# Altium project SmartHaloDD.PrjPcb
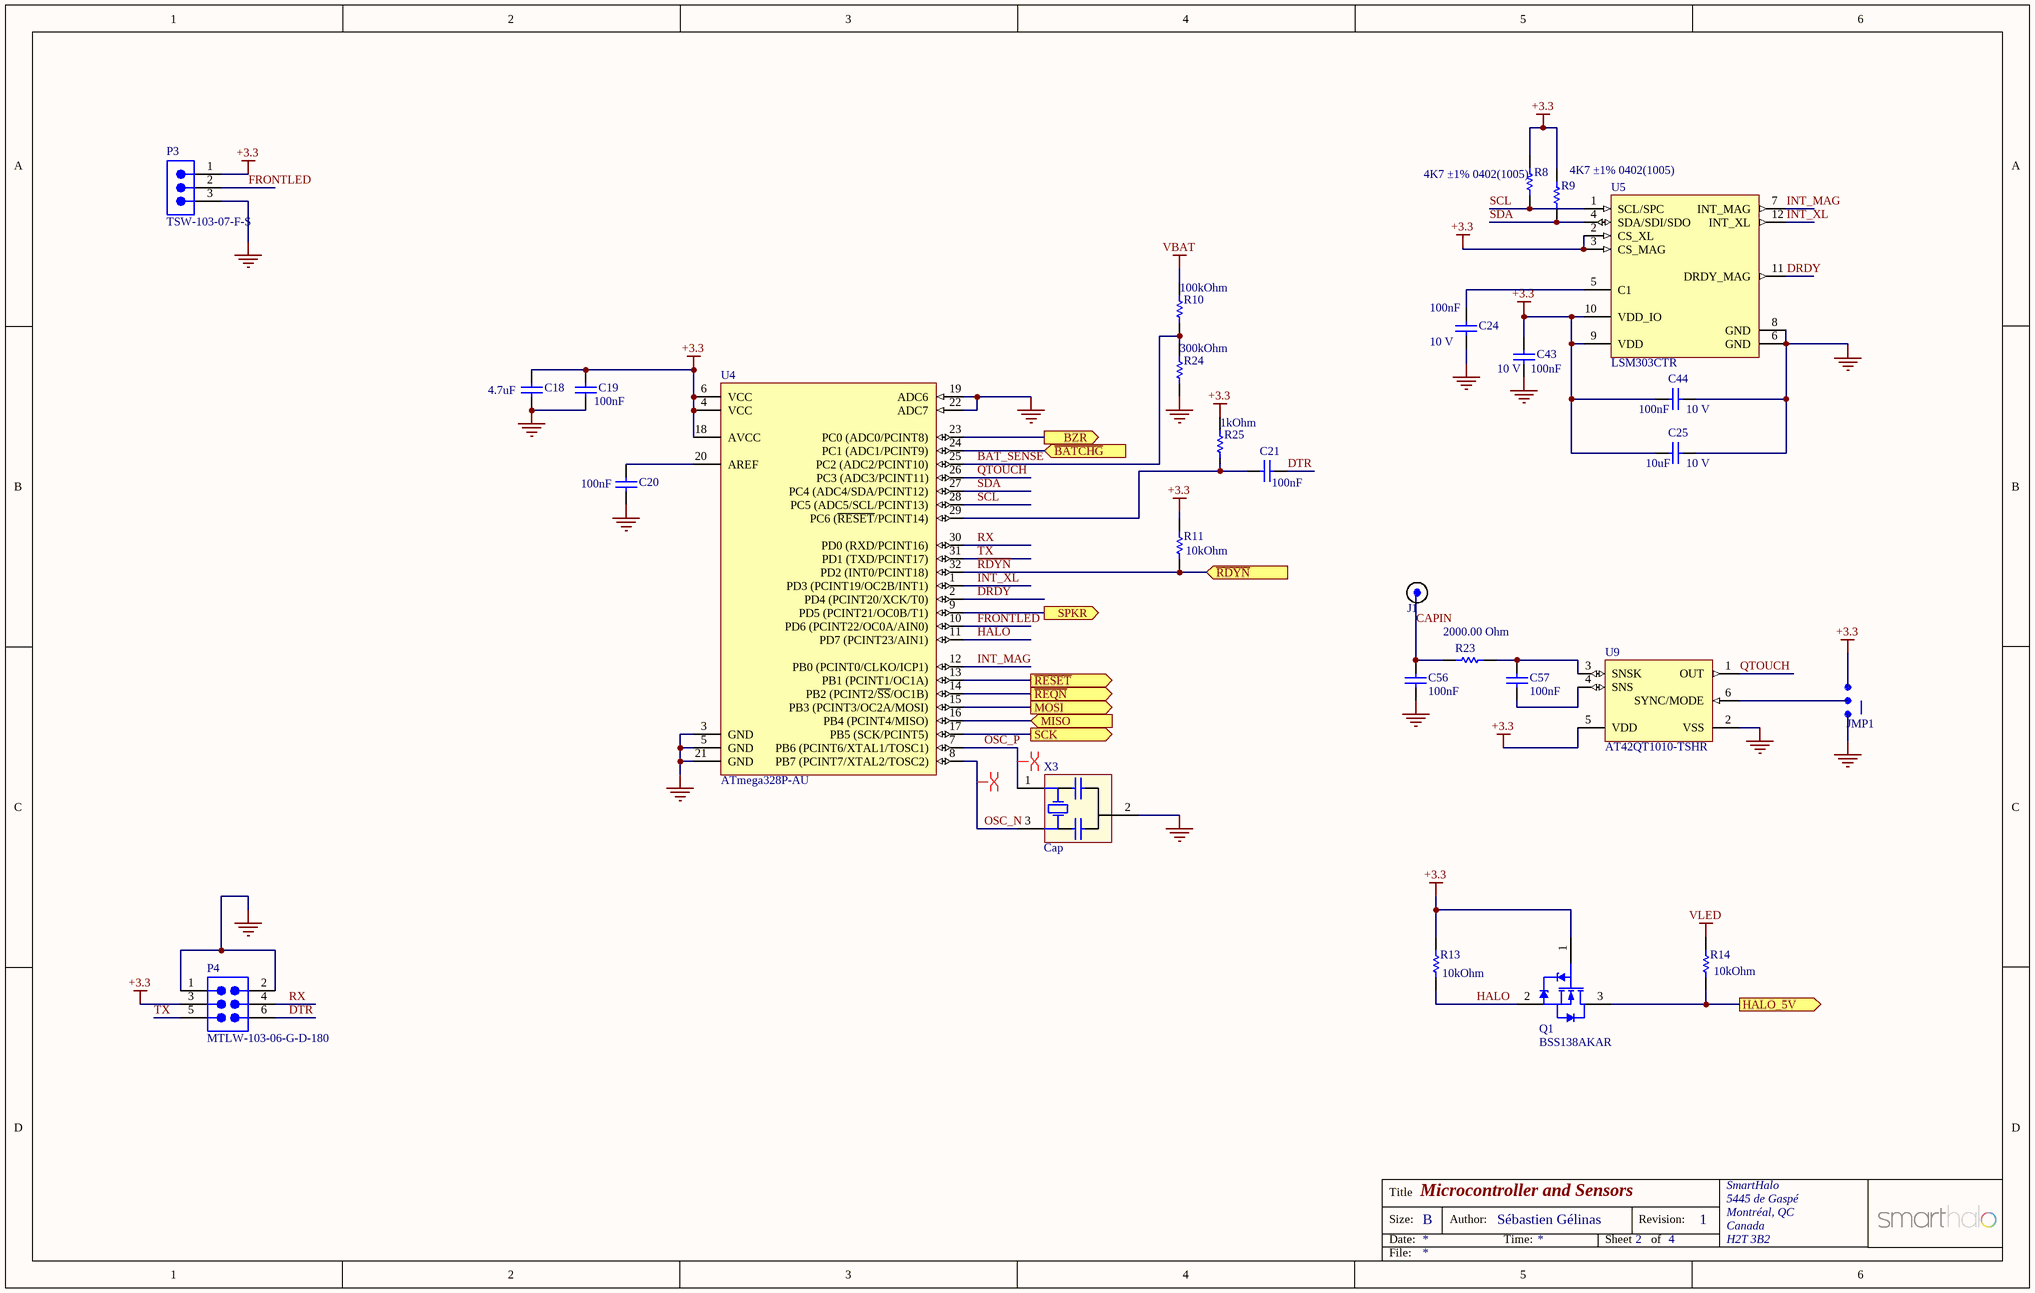
[diagram p0: MCU.SchDoc]
3 sheets, 69 parts. Net scope: flat (ports and power ports of the same name join across sheets).
Sheets:
  MCU.SchDoc
  BLE.SchDoc
  ALARM.SchDoc

## Sheet MCU.SchDoc: Microcontroller and Sensors
size B; Author: Sébastien Gélinas; Organization: SmartHalo; Address1: 5445 de Gaspé; Address2: Montréal, QC; Address3: Canada; Address4: H2T 3B2; DocumentNumber: 2; Revision: 1; SheetNumber: 2; SheetTotal: 4

### Parts
C18  Capacitance: 4.7uF  [CAPC0603(1608)55_N]  (hidden comment: CAP 4.7uF 10V 0603(1608))
C19  Capacitance: 100nF  [CAPC0402(1005)60_L]  (hidden comment: CAP 100nF 10V 0402(1005))
C20  Capacitance: 100nF  [CAPC0402(1005)60_L]  (hidden comment: CAP 100nF 10V 0402(1005))
C21  Capacitance: 100nF  [CAPC0402(1005)60_M]  (hidden comment: CAP 100nF 6.3V 0402(1005))
C24  Capacitance: 100nF  Rated Voltage: 10 V  [CAPC0402(1005)60_L]  (hidden comment: CAP 100nF 10V 0402(1005))
C25  Rated Voltage: 10 V  Capacitance: 10uF  [CAPC0603(1608)100_N]  (hidden comment: CAP 10uF 10V 0603(1608))
C43  Capacitance: 100nF  Rated Voltage: 10 V  [CAPC0402(1005)60_L]  (hidden comment: CAP 100nF 10V 0402(1005))
C44  Capacitance: 100nF  Rated Voltage: 10 V  [CAPC0402(1005)60_L]  (hidden comment: CAP 100nF 10V 0402(1005))
C56  Capacitance: 100nF  [CAPC0402(1005)60_L]  (hidden comment: CAP 100nF 10V 0402(1005))
C57  Capacitance: 100nF  [CAPC0402(1005)60_L]  (hidden comment: CAP 100nF 10V 0402(1005))
J1  HEADERPIN  [HEADERPIN]  (value not drawn)  (no BOM)
JMP1  JUMPER  [JUMPER_SMT]  (value not drawn)  (no BOM)
P3  TSW-103-07-F-S  [SMTC-TSW-103-07-X-S]  (no BOM)
P4  MTLW-103-06-G-D-180  [SMTC-MTLW-103-06-X-D-180]  (no BOM)
Q1  BSS138AKAR  [NXP-SOT23_N]
R8  4K7 ±1% 0402(1005)  [RESC0402(1005)_N]
R9  4K7 ±1% 0402(1005)  [RESC0402(1005)_N]
R10  Resistance: 100kOhm  [RESC0402(1005)_L]  (hidden comment: 100K ±5% 0402(1005))
R11  Resistance: 10kOhm  [RESC0402(1005)_N]  (hidden comment: 10K ±5% 0402(1005))
R13  Resistance: 10kOhm  [RESC0402(1005)_N]  (hidden comment: 10K ±1% 0402(1005))
R14  Resistance: 10kOhm  [RESC0402(1005)_N]  (hidden comment: 10K 1% 0402(1005))
R23  Resistance: 2000.00 Ohm  [RESC0603(1608)_N]  (hidden comment: 2K ±5% 0603(1608))
R24  Resistance: 300kOhm  [RESC0402(1005)_L]  (hidden comment: 300K ±5% 0402(1005))
R25  Resistance: 1kOhm  [RESC0402(1005)_L]  (hidden comment: 1K ±5% 0402(1005))
U4  ATmega328P-AU  [32A_M]
U5  LSM303CTR  [LGA12-2X2X1_N]
U9  AT42QT1010-TSHR  [6ST1_M]
X3  Cap  [CSTCE10M0G55-R0]

### Ports
BZR, HALO_5V (out), MISO (in), MOSI (out), SCK (out), SPKR, ~{BATCHG} (in), ~{RDYN} (in), ~{REQN} (out), ~{RESET} (out)

### Nets
+3.3: C18.2 C19.2 C25.2 C43.1 C44.2 JMP1.1 P3.1 P4.3 Q1.1(G) R8.2 R9.2 R11.2 R13.2 R25.2 U4.4(VCC) U4.6(VCC) U4.18(AVCC) U5.2(CS_XL) U5.3(CS_MAG) U5.9(VDD) U5.10(VDD_IO) U9.5(VDD)
GND: C18.1 C19.1 C20.1 C24.2 C25.1 C43.2 C44.1 C56.1 JMP1.3 P3.3 P4.1 P4.2 R24.1 U4.3(GND) U4.5(GND) U4.19(ADC6) U4.21(GND) U4.22(ADC7) U5.6(GND) U5.8(GND) U9.2(VSS) X3.2(GND)
VBAT: R10.2
VLED: R14.2
BAT_SENSE: R10.1 R24.2 U4.25(PC2_(ADC2/PCINT10))
CAPIN: C56.2 J1.1 R23.2
DRDY: U4.2(PD4_(PCINT20/XCK/T0)) U5.11(DRDY_MAG)
DTR: C21.2 P4.6
FRONTLED: P3.2 U4.10(PD6_(PCINT22/OC0A/AIN0))
HALO: Q1.2(S) R13.1 U4.11(PD7_(PCINT23/AIN1))
INT_MAG: U4.12(PB0_(PCINT0/CLKO/ICP1)) U5.7(INT_MAG)
INT_XL: U4.1(PD3_(PCINT19/OC2B/INT1)) U5.12(INT_XL)
OSC_N: U4.8(PB7_(PCINT7/XTAL2/TOSC2)) X3.3(C2)
OSC_P: U4.7(PB6_(PCINT6/XTAL1/TOSC1)) X3.1(C1)
QTOUCH: U4.26(PC3_(ADC3/PCINT11)) U9.1(OUT)
~{RDYN}: R11.1 U4.32(PD2_(INT0/PCINT18)) ; port ~{RDYN}
RX: P4.4 U4.30(PD0_(RXD/PCINT16))
SCL: R8.1 U4.28(PC5_(ADC5/SCL/PCINT13)) U5.1(SCL/SPC)
SDA: R9.1 U4.27(PC4_(ADC4/SDA/PCINT12)) U5.4(SDA/SDI/SDO)
TX: P4.5 U4.31(PD1_(TXD/PCINT17))
NetC20_2: C20.2 U4.20(AREF)
NetC21_1: C21.1 R25.1 U4.29(PC6_(~{RESET}/PCINT14))
NetC24_1: C24.1 U5.5(C1)
NetC57_1: C57.1 U9.4(SNS)
NetC57_2: C57.2 R23.1 U9.3(SNSK)
NetJMP1_2: JMP1.2 U9.6(SYNC/MODE)
NetQ1_3: Q1.3(D) R14.1 ; port HALO_5V
NetR16_2: U4.9(PD5_(PCINT21/OC0B/T1)) ; port SPKR
NetR18_1: U4.23(PC0_(ADC0/PCINT8)) ; port BZR
NetU4_13: U4.13(PB1_(PCINT1/OC1A)) ; port ~{RESET}
NetU4_14: U4.14(PB2_(PCINT2/~{SS}/OC1B)) ; port ~{REQN}
NetU4_15: U4.15(PB3_(PCINT3/OC2A/MOSI)) ; port MOSI
NetU4_16: U4.16(PB4_(PCINT4/MISO)) ; port MISO
NetU4_17: U4.17(PB5_(SCK/PCINT5)) ; port SCK
NetU4_24: U4.24(PC1_(ADC1/PCINT9)) ; port ~{BATCHG}

### Layout directives
differential pair: OSC_N, OSC_P

### Notes on the sheet
- Title
- Size:
- Date:
- B
- Author:
- Time:
- Sheet
- Revision:
- of
- File:

### Library data of the parts
C18 = CMP-1035-02784-1: CAP 4.7uF 10V ±10% 0603 (1608 Metric); Case-EIA: 0603; Case-Metric: 1608; Tolerance: ±10%; Rated Voltage: 10 V
C19 C20 C24 C43 C44 C56 C57 = CMP-1034-02064-1: CAP 100nF 10V ±5% 0402 (1005 Metric); Case-EIA: 0402; Case-Metric: 1005; Tolerance: ±5%
  C19 C20 C56 C57: Rated Voltage: 10 V
C21 = CMP-1034-02060-1: CAP 100nF 6.3V ±5% 0402 (1005 Metric); Case-EIA: 0402; Case-Metric: 1005; Rated Voltage: 6.3 V; Tolerance: ±5%
C25 = CMP-1035-02799-1: CAP 10uF 10V ±10% 0603 (1608 Metric); Case-EIA: 0603; Case-Metric: 1608; Tolerance: ±10%
J1 = HEADERPIN: HEADER 0.025" PIN
P3 = SMTC-TSW-103-X-X-S-X: 0.025" SQ Post Header, Through-hole, Vertical, -55 to 125 degC, 2.54 mm Pitch, 3-Pin, Male, RoHS; Manufacturer: Samtec; Pitch: 2.54 mm; DatasheetVersion: F-214; ComponentLink1Description: Manufacturer URL; ComponentLink3URL: http://www.samtec.com/documents/webfiles/cpdf/TSW-XXX-XX-XXX-X-XX-XXX-MKT.pdf; Mounting Technology: Through-hole; PackageDescription: .025[0.64] SQ. Post Terminal Strip Assembly; Temperature Range: -55 to 125 degC; ComponentLink3Description: Package Specification; Orientation: Vertical; PartNumber: TSW-103-07-F-S; RoHS: True; PackageVersion: DM, 8/1988; ComponentLink2Description: Datasheet; ComponentLink1URL: http://www.samtec.com; ComponentLink2URL: http://www.samtec.com/documents/webfiles/pdf/TSW_TH.PDF; PackageReference: TSW-103-07-X-S
P4 = SMTC-MTLW-103-06-X-D-180: Low Profile .025" SQ Post Header, Through-hole, Vertical, -55 to 125 degC, 2.54 mm Pitch, 6-Pin, Male, RoHS; Manufacturer: Samtec; Pitch: 2.54 mm; PartNumber: MTLW-103-06-G-D-180; ComponentLink2Description: Datasheet; ComponentLink3URL: http://www.samtec.com/documents/webfiles/cpdf/MTLW-1XX-XX-XX-X-XXX-XX-XX-MKT1.pdf; ComponentLink1URL: http://www.samtec.com; Orientation: Vertical; PackageVersion: T, 6/1991; PackageDescription: Low Profile Terminal Assembly; ComponentLink3Description: Package Specification; ComponentLink1Description: Manufacturer URL; DatasheetVersion: F-214; Temperature Range: -55 to 125 degC; ComponentLink2URL: http://www.samtec.com/documents/webfiles/pdf/MTLW_TH.PDF; RoHS: True; Mounting Technology: Through-hole; PackageReference: MTLW-103-06-X-D-180
Q1 = CMP-1258-00119-1: Single N-Channel Trench MOSFET, 60 V, 0.2 A, -55 to 150 degC, 3-Pin SOT23, Tape and Reel; Manufacturer: NXP Semiconductors; ID [max] (A): 0.2; VGSth [typ] (V): 1.2; VDS [max] (V): 60; Coss [typ] (pF): 21; Ciss [typ] (pF): 31; Channel Type: N; Packing: Tape & Reel; ComponentLink1URL: http://www.nxp.com/; ComponentLink2URL: http://www.nxp.com/documents/data_sheet/BSS138AKA.pdf; ComponentLink3Description: Package Specification; PackageVersion: 06-03-16, 03/2006; ComponentLink2Description: Datasheet; ComponentLink3URL: http://www.nxp.com/documents/outline_drawing/sot023_po.pdf; PackageDescription: 3-Pin Small Outline Transistor Package, Body 2.9 x 1.3 mm, Pitch 0.95 mm; ComponentLink1Description: Manufacturer URL; PackageReference: SOT23; Code_JEDEC: TO-236AB; DatasheetVersion: Rev. 1; Mounting Technology: Surface Mount; PartNumber: BSS138AKAR
R8 R9 = CMP-1011-00586-1: 4K7 0.063W ±1% 0402 (1005 Metric); Resistance: 4700.00 Ohm; Case-EIA: 0402; Case-Metric: 1005; Power: 0.063 W; Tolerance: ±1 %
R10 = CMP-1011-00074-1: 100K 0.063W ±5% 0402 (1005 Metric); Case-EIA: 0402; Case-Metric: 1005; Tolerance: ±5 %; Power: 0.063 W
R11 = CMP-1011-00098-1: 10K 0.063W ±5% 0402 (1005 Metric); Case-EIA: 0402; Case-Metric: 1005; Tolerance: ±5 %; Power: 0.063 W
R13 R14 = CMP-1011-00623-1: 10K 0.063W ±1% 0402 (1005 Metric); Case-Metric: 1005; Case-EIA: 0402; Tolerance: ±1 %; Power: 0.063 W
R23 = CMP-1012-00081-1: 2K 0.1W ±5% 0603 (1608 Metric); Case-EIA: 0603; Case-Metric: 1608; Tolerance: ±5 %; Power: 0.1 W
R24 = CMP-1011-00074-1: 300K 0.063W ±5% 0402 (1005 Metric); Case-EIA: 0402; Case-Metric: 1005; Tolerance: ±5 %; Power: 0.063 W
R25 = CMP-1011-00074-1: 1K 0.063W ±5% 0402 (1005 Metric); Case-EIA: 0402; Case-Metric: 1005; Tolerance: ±5 %; Power: 0.063 W
U4 = MC-8B-ATM48-SQ32: 8-bit AVR Microcontroller, 32KB Flash, 1KB EEPROM, 2KB SRAM, 32-pin TQFP, Industrial Grade (-40Â°C to 85Â°C); PackageDescription: 32-Lead, 7x7x1.0 mm Body, 0.8mm Lead Pitch, Thin Profile Plastic Quad Flat Package (TQFP); DatasheetVersion: revD, May-2011; RevisionNote: DatasheetVersion & PackageVersion updated. URLs added.; ComponentLink1URL: http://www.atmel.com/; ComponentLink2Description: ATmega48A/48PA/88A/88PA/168A/168PA/328/328P Datasheet; Code_JEDEC: MS-026-ABA; ComponentLink1Description: Manufacturer URL; PackageReference: 32A; ComponentLink3Description: ATmega48A/48PA/88A/88PA/168A/168PA/328/328P Summary; ComponentLink2URL: http://www.atmel.com/dyn/resources/prod_documents/doc8271.pdf; PackageVersion: revC, Oct-2010; ComponentLink3URL: http://www.atmel.com/dyn/resources/prod_documents/8271S.pdf
U5 = SEN-MOT-LSM303CTR-12: 3D ACCELEROMETER/MAGNETOMETER
U9 = CMP-0073-00038-1: One-channel Touch Sensor IC with Reset Timer, -40Â° to +85Â° C, 6-pin SOT23; DatasheetVersion: revH, May-2010; Code_IPC: SOT26A-6; PackageDescription: 6-Lead, 2.90 x 1.60 mm Plastic Small Outline Package (SOT23); PackageVersion: revA, Jun-2008; PackageReference: 6ST1; ComponentLink2Description: Datasheet; ComponentLink2URL: http://www.atmel.com/Images/doc9541.pdf; ComponentLink1URL: http://www.atmel.com/; ComponentLink1Description: Manufacturer URL; Code_JEDEC: MO-178-AB
X3 = CSTCE10M0G55-R0: CER RESONATOR 10.0MHZ SMD

## Sheet BLE.SchDoc: RF/Bluetooth
size B; Author: Sébastien Gélinas; Organization: SmartHalo; Address1: 5445 de Gaspé; Address2: Montréal, QC; Address3: Canada; Address4: H2T 3B2; DocumentNumber: 4; Revision: 1; SheetNumber: 4; SheetTotal: 4
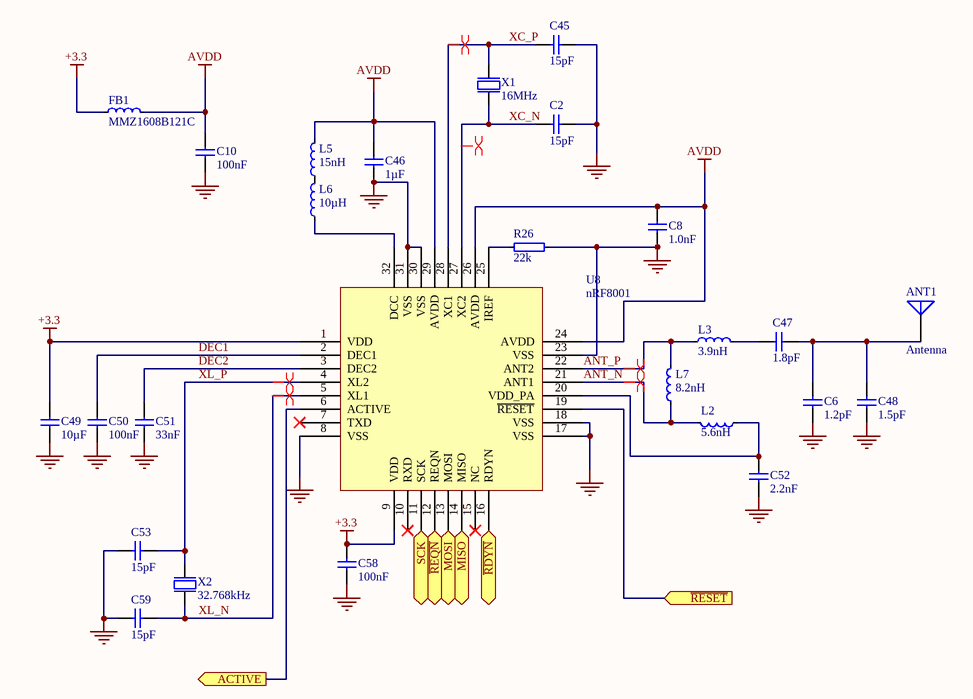
[diagram p1: BLE.SchDoc]

### Parts
ANT1  Antenna  [ANTENNA_PCB_2.4GHZ]  (no BOM)
C2  15pF  [CAPC0805(2012)100_N]
C6  1.2pF  [0402s]
C8  1.0nF  [CAPC0603(1608)100_N]
C10  100nF  [CAPC0805(2012)100_N]
C45  15pF  [CAPC0805(2012)100_N]
C46  1µF  [CAPC0805(2012)100_N]
C47  1.8pF  [0402s]
C48  1.5pF  [0402s]
C49  10µF  [CAPC0805(2012)100_N]
C50  100nF  [CAPC0805(2012)100_N]
C51  33nF  [CAPC0805(2012)100_N]
C52  2.2nF  [0402s]
C53  15pF  [CAPC0805(2012)100_N]
C58  100nF  [CAPC0805(2012)100_N]
C59  15pF  [CAPC0805(2012)100_N]
FB1  MMZ1608B121C  [CAPC0805(2012)100_N]
L2  5.6nH  [0402s]
L3  3.9nH  [0402s]
L5  15nH  [CAPC0603(1608)100_N]
L6  10µH  [CAPC0603(1608)100_N]
L7  8.2nH  [0402s]
R26  22k  [RESC0805(2012)_N]
U8  nRF8001  [Nordic_QFN50P500X500X90-33N]
X1  16MHz  [CRYSTAL_16MHz_SMT4]
X2  32.768kHz  [CRYSTAL_32.768kHz_SMT2]

### Ports
ACTIVE (out), MISO (out), MOSI (in), SCK (in), ~{RDYN} (out), ~{REQN} (in), ~{RESET} (in)

### Nets
+3.3: C49.2 C58.2 FB1.1 U8.1(VDD) U8.9(VDD)
AVDD: C8.1 C10.2 C46.2 FB1.2 L5.2 U8.24(AVDD) U8.26(AVDD) U8.29(AVDD)
GND: C2.1 C6.2 C8.2 C10.1 C45.1 C46.1 C48.2 C49.1 C50.1 C51.1 C52.1 C53.1 C58.1 C59.1 R26.2 U8.8(VSS) U8.17(VSS) U8.18(VSS) U8.23(VSS) U8.30(VSS) U8.31(VSS) U8.33(GND) X1.2(GND) X1.4(GND)
ANT_N: L2.2 L7.1 U8.21(ANT1)
ANT_P: L3.1 L7.2 U8.22(ANT2)
DEC1: C50.2 U8.2(DEC1)
DEC2: C51.2 U8.3(DEC2)
~{RDYN}: U8.16(RDYN) ; port ~{RDYN}
XC_N: C2.2 U8.27(XC2) X1.3(out)
XC_P: C45.2 U8.28(XC1) X1.1(inp)
XL_N: C59.2 U8.5(XL1) X2.2(out)
XL_P: C53.2 U8.4(XL2) X2.1(inp)
NetANT1_1: ANT1.1 C6.1 C47.1 C48.1
NetC47_2: C47.2 L3.2
NetC52_2: C52.2 L2.1 U8.20(VDD_PA)
NetL5_1: L5.1 L6.2
NetL6_1: L6.1 U8.32(DCC)
NetR26_1: R26.1 U8.25(IREF)
NetU4_13: U8.19(~{RESET}) ; port ~{RESET}
NetU4_14: U8.12(REQN) ; port ~{REQN}
NetU4_15: U8.13(MOSI) ; port MOSI
NetU4_16: U8.14(MISO) ; port MISO
NetU4_17: U8.11(SCK) ; port SCK
NetU8_6: U8.6(ACTIVE) ; port ACTIVE

Not connected (* = marked no-connect by the designer): U8 7(TXD)* 10(RXD)* 15(NC)*

### Layout directives
differential pair: ANT_N, ANT_P, XC_N, XC_P, XL_N, XL_P

### Notes on the sheet
- Title
- Size:
- Date:
- B
- Author:
- Time:
- Sheet
- Revision:
- of
- File:

### Library data of the parts
ANT1 = ANTENNA_PCB_2.4GHz: Antenna PCB, 2.4GHz, 26.11 mm x 1.27 mm, FR4 60 mils, Er = 4.2
C2 C45 C53 C59 = C0402-15p: CAP 15pF *V ±5% NP0 0805 (2012 Metric); Case-EIA: 0805; Case-Metric: 2012; Capacitance: 15pF; Tolerance: ±5%; Rated Voltage: *; Dielectric: NP0
C6 = C0402-1.2p: CAP 1.2pF *V ±5% NP0 0402 (1005 Metric); Case-EIA: 0402; Case-Metric: 1005; Capacitance: 1.2pF; Dielectric: NP0; Tolerance: ±5%; Rated Voltage: *
C8 = C0402-1n0: CAP 1.0nF *V ±10% X7R 0603 (1608 Metric); Case-EIA: 0603; Case-Metric: 1608; Capacitance: 1.0nF; Rated Voltage: *; Tolerance: ±10%; Dielectric: X7R
C10 = C0402-100n: CAP 100nF *V ±10% X7R 0805 (2012 Metric); Case-EIA: 0805; Case-Metric: 2012; Capacitance: 100nF; Rated Voltage: *; Tolerance: ±10%; Dielectric: X7R
C46 = C0603-1µ0: CAP 1.0uF 10V ±10% X7R 0805 (2012 Metric); Manufacturer: TAIYO YUDEN; Manufacturer Part Number: LMK107B7105KA-T; Case-EIA: 0805; Case-Metric: 2012; Capacitance: 1µF; Rated Voltage: 10V; Tolerance: ±10%; Dielectric: X7R
C47 = C0402-1.8p: CAP 1.8pF *V ±0.1pF NP0 0402 (1005 Metric); Manufacturer: JOHANSON TECHNOLOGY; Manufacturer Part Number: 500R07S1R8BV4T; Case-EIA: 0402; Case-Metric: 1005; Capacitance: 1.8pF; Dielectric: NP0; Tolerance: ±0.1pF; Rated Voltage: *
C48 = C0402-1.2p: CAP 1.5pF *V ±5% NP0 0402 (1005 Metric); Case-EIA: 0402; Case-Metric: 1005; Capacitance: 1.5pF; Tolerance: ±5%; Dielectric: NP0; Rated Voltage: *
C49 = C0603-1µ0: CAP 10uF 10V ±10% X7R 0805 (2012 Metric); Manufacturer: TAIYO YUDEN; Manufacturer Part Number: LMK107B7105KA-T; Case-EIA: 0805; Case-Metric: 2012; Capacitance: 10µF; Dielectric: X7R; Rated Voltage: 10V; Tolerance: ±10%
C50 = C0402-100n: CAP 100nF 10V ±10% X7R 0805 (2012 Metric); Case-EIA: 0805; Case-Metric: 2012; Capacitance: 100nF; Tolerance: ±10%; Dielectric: X7R; Rated Voltage: 10V
C51 = C0402-33n: CAP 33nF 10V ±10% X7R 0805 (2012 Metric); Note: Chip Cap 10%; Case-EIA: 0805; Case-Metric: 2012; Capacitance: 33nF; Tolerance: ±10%; Dielectric: X7R; Rated Voltage: 10V
C52 = C0402-2n2: CAP 2.2nF *V ±10% X7R 0402 (1005 Metric); Case-EIA: 0402; Case-Metric: 1005; Capacitance: 2.2nF; Dielectric: X7R; Tolerance: ±10%; Rated Voltage: *
C58 = C0402-100n: CAP 100nF *V ±10% X7R 0805 (2012 Metric); Note: Chip Cap 10%; Case-EIA: 0805; Case-Metric: 2012; Capacitance: 100nF; Tolerance: ±10%; Rated Voltage: *; Dielectric: X7R
FB1 = L0402-15n: Ferrite bead 0805; Case-EIA: 0805; Case-Metric: 2012
L2 = L0402-5n6: IND 5.6nH 0402 (1005 Metric); Manufacturer: Murata; Manufacturer Part Number: LQP15MN5N6B02D; Note: LQP15MN5N6B02D 5.6nH 140mA 0402; Case-EIA: 0402; Case-Metric: 1005; Value: 5.6nH
L3 = L0402-3n9: IND 3.9nH 0402 (1005 Metric); Manufacturer: Murata; Manufacturer Part Number: LQP15MN3N9B02D; Note: LQP15MN3N9B02D 3.9nH 170mA 0402; Case-EIA: 0402; Case-Metric: 1005; Inductance: 3.9nH
L5 = L0402-15n: IND 15nH 0603 (1608 Metric); Case-EIA: 0603; Case-Metric: 1608; Inductance: 15nH
L6 = L0603-10µ: IND 10uH 0603 (1608 Metric); Manufacturer: Taiyo Yuden; Manufacturer Part Number: LBMF1608T100K; Case-EIA: 0603; Case-Metric: 1608; Inductance: 10µH
L7 = L0402-8n2: IND 8.2nH 0402 (1005 Metric); Manufacturer Part Number: LQP15MN8N2B02D; Note: LQP15MN8N2B02D 8.2nH 110mA 0402; Case-EIA: 0402; Case-Metric: 1005; Inductance: 8.2nH
R26 = R0402-22k: 22K *W 1% 0805 (2012 Metric); Note: Chip Res 1%; Case-EIA: 0805; Case-Metric: 2012; Resistance: 22k; Tolerance: ±1%; Power: *
U8 = nRF8001: IC BLUETOOTH TRANSCEIVER 32QFN
X1 = XTAL_TSX-3225: XTAL SMD 16MHz, 9pF, Mercury; Part Number: XTAL SMD 16MHz (3225); Note: XTAL SMD 16MHz 3225; Artikkelnr Noca: 22019087; Value: 16MHz; Manufacturer: *; Manufacturer Part Number: *; Datasheet: http://ndap3-net.ebz.epson.co.jp/w/www/PDFS/epdoc_qd.nsf/85a4e2c523a1f89349257068002f9e30/31e98956c8f991cd4925707c003b38b1/$FILE/FA-238_238V_TSX-3225_E08X.pdf; Footprint: BT-XTAL_3225; LatestRevisionDate: 2010-02-24; Pin Count: 4; Publisher: Nordic Semiconductor; Published: 2009-05-30; Supplier: *; Supplier part number: *; 2nd source Supplier: *; 2nd source part number: *
X2 = XTAL_FC-135 32.768k: EPSON TOYOCOM - FC-135 32.768KHZ ±20PPM,9.0PF - CRYSTAL, SM, WATCH; Note: XTAL SMD 32.768kHz, 3215; Artikkelnr Noca: 2.20191e+007; Part Number: XTAL_FC-135 32.768k; Manufacturer: Epson Toyocom; Manufacturer Part Number: FC-135 32.768KHZ ±20PPM,9.0PF; Datasheet: http://www.farnell.com/datasheets/57480.pdf; Footprint: FC-135; LatestRevisionDate: 2010-10-18; Pin Count: 2; Publisher: Nordic Semiconductor; Published: 2010-10-18; Value: 32.768kHz; Supplier: Farnell; Supplier part number: 127-8037; 2nd source Supplier: *; 2nd source part number: *

## Sheet ALARM.SchDoc: Alarm and sound
size B; Author: Sebastien Gelinas; CompanyName: SmartHalo; Organization: SmartHalo; Address1: 5445 de Gaspé; Address2: Montréal, QC; Address3: Canada; Address4: H2T 3B2; Revision: 1; SheetNumber: 5; SheetTotal: 5
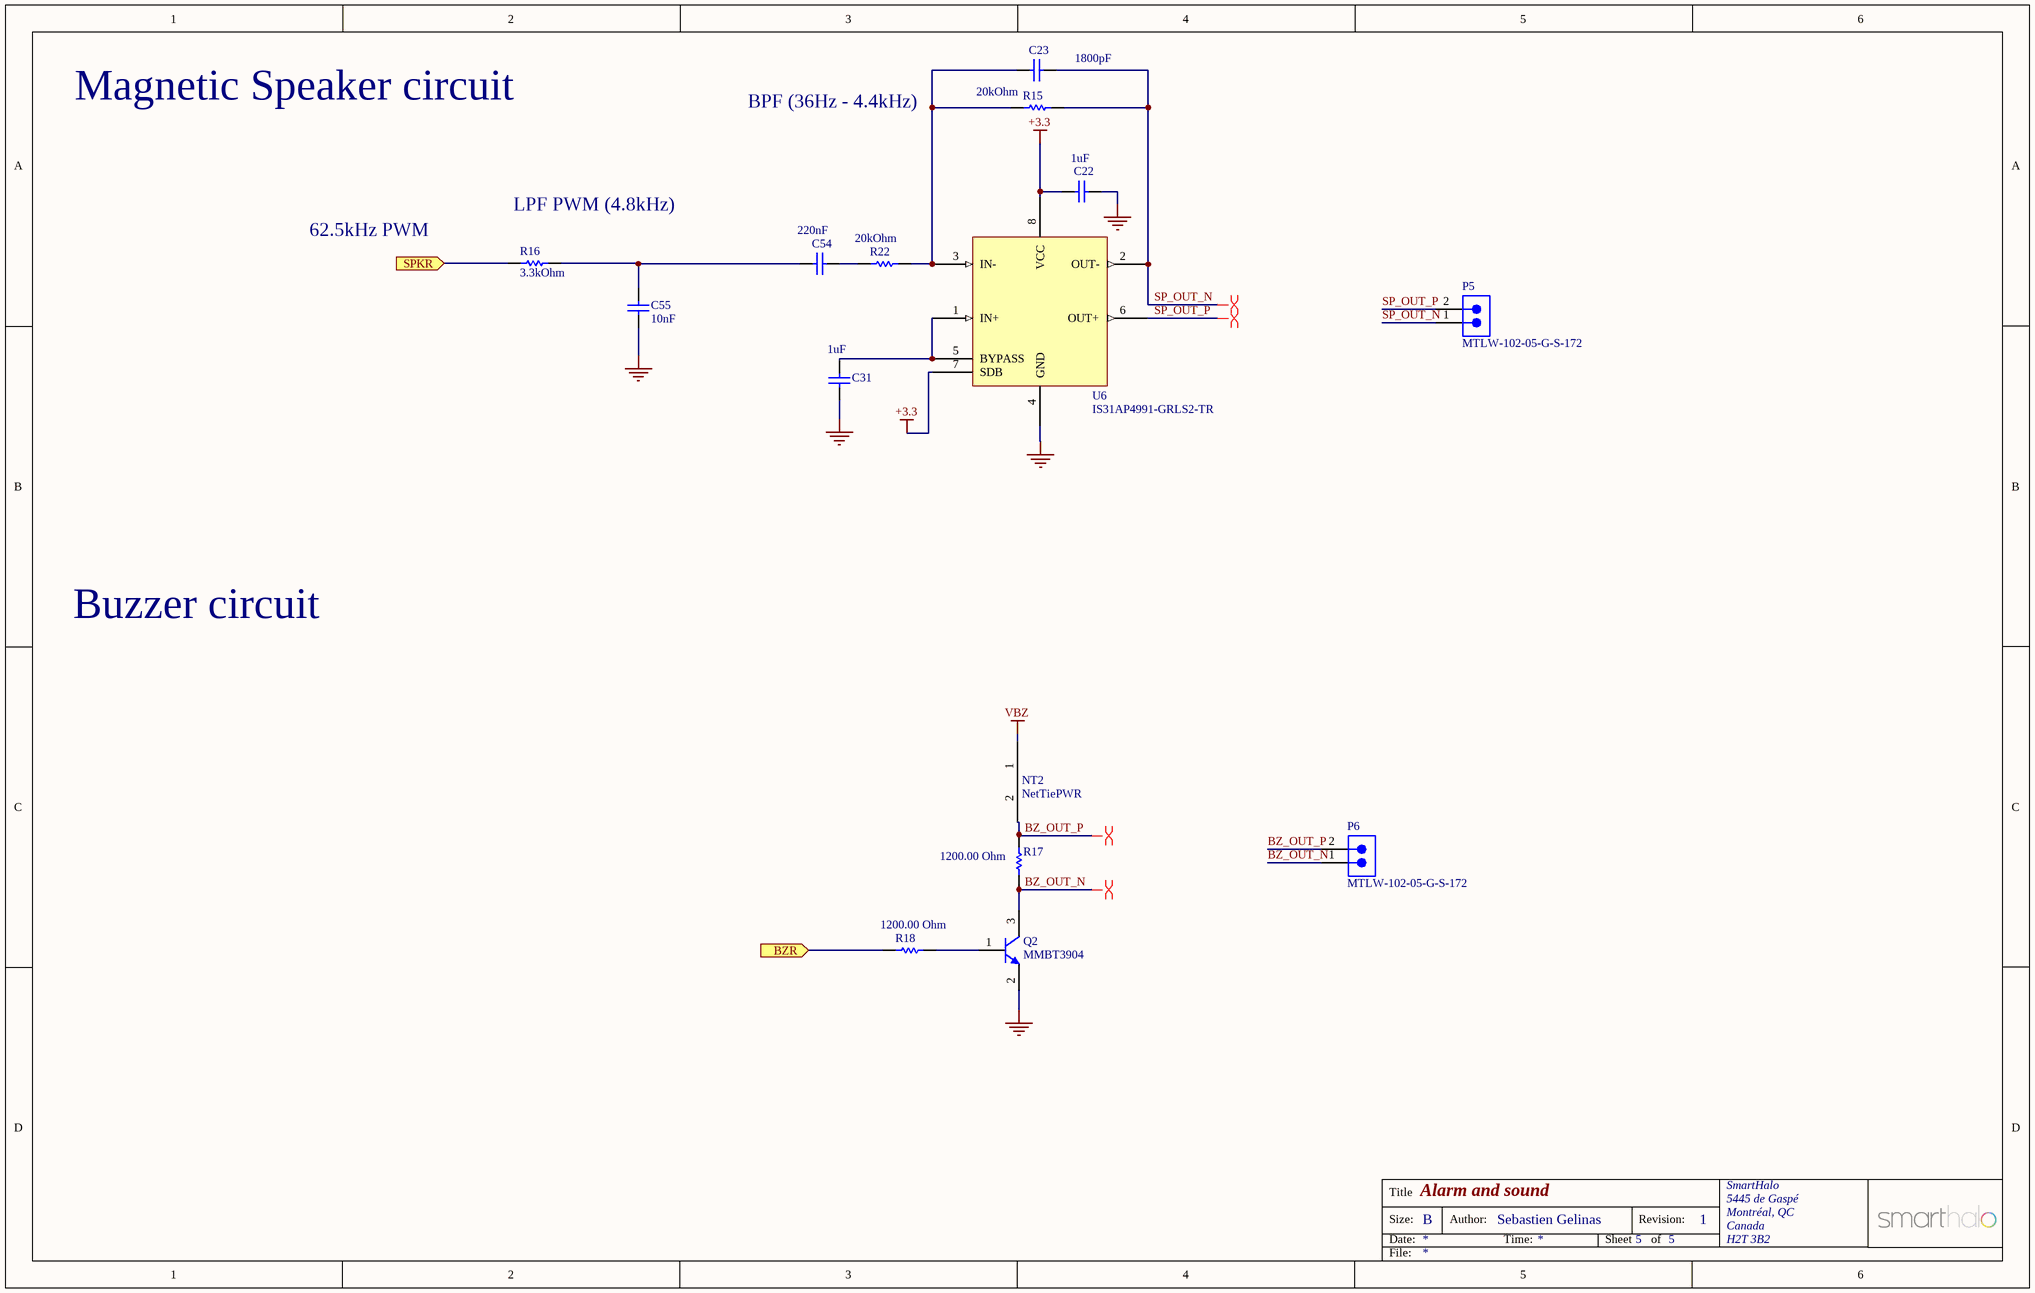
[diagram p2: ALARM.SchDoc]

### Parts
C22  Capacitance: 1uF  [CAPC0402(1005)60_L]  (hidden comment: CAP 1uF 6.3V 0402(1005))
C23  Capacitance: 1800pF  [CAPC0402(1005)60_N]  (hidden comment: CAP 1800pF 6.3V 0402(1005))
C31  Capacitance: 1uF  [CAPC0402(1005)60_L]  (hidden comment: CAP 1uF 6.3V 0402(1005))
C54  Capacitance: 220nF  [CAPC0402(1005)60_N]  (hidden comment: CAP 220nF 6.3V 0402(1005))
C55  Capacitance: 10nF  [CAPC0402(1005)60_N]  (hidden comment: CAP 10nF 6.3V 0402(1005))
NT2  NetTiePWR  [NetTiePWR]  (net tie, no BOM)
P5  MTLW-102-05-G-S-172  [SMTC-MTLW-102-05-X-S-172]  (no BOM)
P6  MTLW-102-05-G-S-172  [SMTC-MTLW-102-05-X-S-172]  (no BOM)
Q2  MMBT3904  [INF-SOT23_L]
R15  Resistance: 20kOhm  [RESC0402(1005)_M]  (hidden comment: 20K 5% 0402(1005))
R16  Resistance: 3.3kOhm  [RESC0402(1005)_M]  (hidden comment: 3K3 5% 0402(1005))
R17  Resistance: 1200.00 Ohm  [RESC0402(1005)_N]  (hidden comment: 1K2 ±5% 0402(1005))
R18  Resistance: 1200.00 Ohm  [RESC0402(1005)_N]  (hidden comment: 1K2 5% 0402(1005))
R22  Resistance: 20kOhm  [RESC0402(1005)_M]  (hidden comment: 20K 5% 0402(1005))
U6  IS31AP4991-GRLS2-TR  [SOP8]

### Ports
BZR, SPKR

### Nets
+3.3: C22.2 U6.7(SDB) U6.8(VCC)
GND: C22.1 C31.1 C55.1 Q2.2(E) U6.4(GND)
VBZ: NT2.1(NET1)
BZ_OUT_N: P6.1 Q2.3(C) R17.1
BZ_OUT_P: NT2.2(NET2) P6.2 R17.2
SP_OUT_N: C23.2 P5.1 R15.2 U6.2(OUT-)
SP_OUT_P: P5.2 U6.6(OUT+)
NetC23_1: C23.1 R15.1 R22.2 U6.3(IN-)
NetC31_2: C31.2 U6.1(IN+) U6.5(BYPASS)
NetC54_1: C54.1 C55.2 R16.1
NetC54_2: C54.2 R22.1
NetQ2_1: Q2.1(B) R18.2
NetR16_2: R16.2 ; port SPKR
NetR18_1: R18.1 ; port BZR

### Layout directives
differential pair: BZ_OUT_N, BZ_OUT_P, SP_OUT_N, SP_OUT_P

### Notes on the sheet
- Magnetic Speaker circuit
- BPF (36Hz - 4.4kHz)
- 62.5kHz PWM
- (near R16) LPF PWM (4.8kHz)
- Buzzer circuit
- Title
- Size:
- Date:
- B
- Author:
- Time:
- Sheet
- Revision:
- of
- File:

### Library data of the parts
C22 C31 = CMP-1034-02113-1: CAP 1uF 6.3V ±10% 0402 (1005 Metric); Case-Metric: 1005; Case-EIA: 0402; Tolerance: ±10%; Rated Voltage: 6.3 V
C23 = CMP-1034-01350-1: CAP 1800pF 6.3V ±10% 0402 (1005 Metric); Case-Metric: 1005; Case-EIA: 0402; Tolerance: ±10%; Rated Voltage: 6.3 V
C54 = CMP-1034-01350-1: CAP 220nF 6.3V ±10% 0402 (1005 Metric); Case-Metric: 1005; Case-EIA: 0402; Tolerance: ±10%; Rated Voltage: 6.3 V
C55 = CMP-1034-01350-1: CAP 10nF 6.3V ±10% 0402 (1005 Metric); Case-Metric: 1005; Case-EIA: 0402; Max Thickness: 0.6 mm; Tolerance: ±10%; Rated Voltage: 6.3 V; Technology: SMT
P5 P6 = CMP-1024-00064-1: Low Profile .025" SQ Post Header, Through-hole, Vertical, -55 to 125 degC, 2.54 mm Pitch, 2-Pin, Male, RoHS; Manufacturer: Samtec; Pitch: 2.54 mm; ComponentLink2URL: http://www.samtec.com/documents/webfiles/pdf/MTLW_TH.PDF; PackageDescription: Low Profile Terminal Assembly; ComponentLink3URL: http://www.samtec.com/documents/webfiles/cpdf/MTLW-1XX-XX-XX-X-XXX-XX-XX-MKT1.pdf; PackageReference: MTLW-102-05-X-S-172; Mounting Technology: Through-hole; ComponentLink2Description: Datasheet; PackageVersion: T, 6/1991; Orientation: Vertical; DatasheetVersion: F-214; RoHS: True; ComponentLink3Description: Package Specification; ComponentLink1URL: http://www.samtec.com; Temperature Range: -55 to 125 degC; PartNumber: MTLW-102-05-G-S-172; ComponentLink1Description: Manufacturer URL
Q2 = CMP-1178-00008-1: NPN Silicon Switching Transistor, 40 V VCEO, 200 mA IC, SOT23, Reel, Green; Manufacturer: Infineon; IC (max): 200 mA; VCBO (max): 60 V; VCE (max): 1 V; Green: TRUE; ICBO (max): 50 nA; IC: 10 mA; VCEO (max): 40 V; VEBO (max): 6 V; ComponentLink3Description: Package Specification; ComponentLink2Description: Datasheet; PackageDescription: 3-Pin Small Outline Transistor Package, 1.3 x 2.9 mm Body, 0.95 mm Pitch; Packing: Reel; ComponentLink1Description: Manufacturer URL; Polarity: NPN; ComponentLink3URL: http://www.infineon.com/dgdl/SOT23-Package_Overview.pdf?folderId=db3a30431936bc4b0119532290053c66&fileId=db3a30431936bc4b0119533468123c85; PackageReference: SOT23; Mounting Technology: Surface Mount; VCE: 1 V; ComponentLink2URL: http://www.infineon.com/dgdl/smbt3904series_mmbt3904.pdf?folderId=db3a30431441fb5d011445fab851018e&fileId=db3a30431441fb5d0114460005c10191; PartNumber: MMBT3904; PackageVersion: Apr-08; ComponentLink1URL: http://www.infineon.com/
R15 R22 = CMP-1011-00105-1: 20K 0.063W ±5% 0402 (1005 Metric); Case-EIA: 0402; Case-Metric: 1005; Tolerance: ±5 %; Power: 0.063 W
R16 = CMP-1011-00105-1: 3K3 0.063W ±5% 0402 (1005 Metric)  SMD; Case-EIA: 0402; Case-Metric: 1005; Tolerance: ±5 %; Power: 0.063 W
R17 = CMP-1011-00076-1: 1K2 0.063W ±5% 0402 (1005 Metric); Case-Metric: 1005; Case-EIA: 0402; Power: 0.063 W; Tolerance: ±5 %
R18 = CMP-1011-00076-1: 1K2 0.063W ±5% 0402 (1005 Metric)  SMD; Case-Metric: 1005; Case-EIA: 0402; Power: 0.063 W; Tolerance: ±5 %
U6 = IS31AP4991-GRLS2-TR: IC AUDIO AMP MONO 1.2W 8SOP

## Nets that join several sheets
+3.3: MCU (22 pins), BLE (5 pins), ALARM (C22.2 U6.7 U6.8)
GND: MCU (22 pins), BLE (24 pins), ALARM (5 pins)
NetR16_2: MCU (U4.9), ALARM (R16.2)
NetR18_1: MCU (U4.23), ALARM (R18.1)
NetU4_13: MCU (U4.13), BLE (U8.19)
NetU4_14: MCU (U4.14), BLE (U8.12)
NetU4_15: MCU (U4.15), BLE (U8.13)
NetU4_16: MCU (U4.16), BLE (U8.14)
NetU4_17: MCU (U4.17), BLE (U8.11)
~{RDYN}: MCU (R11.1 U4.32), BLE (U8.16)

## Assembly variants
: all parts fitted